# EAGLE design transmitter (EAGLE 5.10)
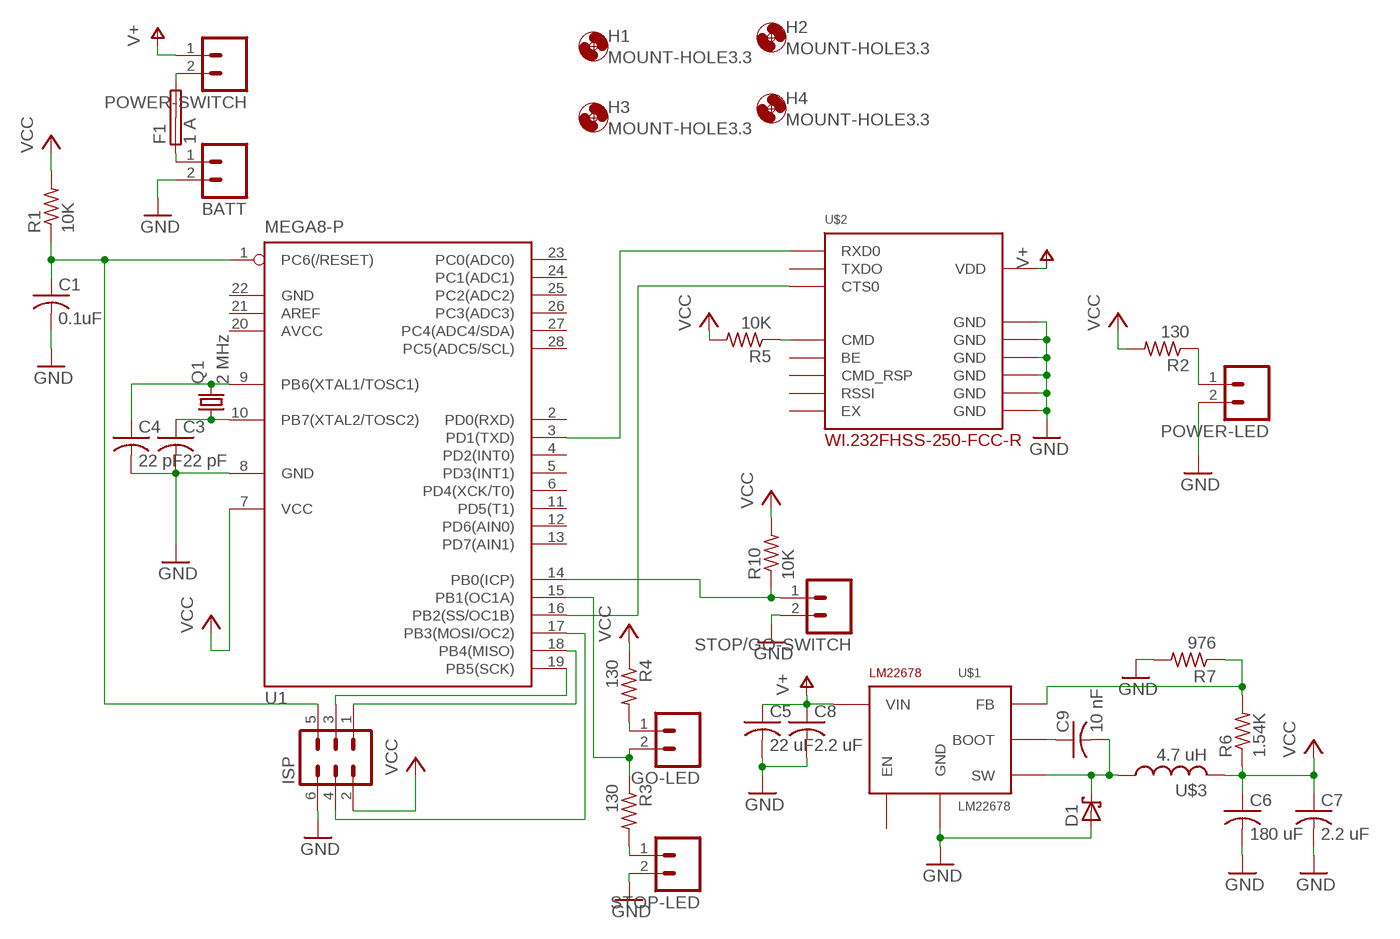
[diagram p0: schematic, sheet 1]

## Parts
BATT  M02POLAR  [MOLEX-1X2]
C1  0.1uF  C-USC1206  [C1206]
C3  22 pF  C-USC1206  [C1206]
C4  22 pF  C-USC1206  [C1206]
C5  22 uF  C-USC1206  [C1206]
C6  180 uF  C-USC1206  [C1206]
C7  2.2 uF  C-USC1206  [C1206]
C8  2.2 uF  C-USC1206  [C1206]
C9  10 nF  C-USC1206  [C1206]
D1  SCHOTTKY-DIODEDO201T15  [DO201T15]
F1  1 A  SHK20Q  [SHK20Q]
GO-LED  M02POLAR  [MOLEX-1X2]
H1  MOUNT-HOLE3.3  [3,3]
H2  MOUNT-HOLE3.3  [3,3]
H3  MOUNT-HOLE3.3  [3,3]
H4  MOUNT-HOLE3.3  [3,3]
ISP  MA03-2  [MA03-2]
POWER-LED  M02POLAR  [MOLEX-1X2]
POWER-SWITCH  M02POLAR  [MOLEX-1X2]
Q1  2 MHz  CRYSTALHC49S  [HC49/S]
R1  10K  R-US_R1206  [R1206]
R2  130  R-US_R1206  [R1206]
R3  130  R-US_R1206  [R1206]
R4  130  R-US_R1206  [R1206]
R5  10K  R-US_R1206  [R1206]
R6  1.54K  R-US_R1206  [R1206]
R7  976  R-US_R1206  [R1206]
R10  10K  R-US_R1206  [R1206]
STOP-LED  M02POLAR  [MOLEX-1X2]
STOP/GO-SWITCH  M02POLAR  [MOLEX-1X2]
U1  MEGA8-P  [DIL28-3]
U$1  LM22678  [TO263-7]
U$2  WI.232FHSS-250-FCC-R  [RADIOTRONIX-EVM]
U$3  4.7 uH  COILTRONICS-DR127  [COILTRONICS-DR127]

## Nets
GND: BATT.2 C1.2 C3.2 C4.2 C5.2 C6.2 C7.2 C8.2 D1.A ISP.6 POWER-LED.2 R7.2 STOP-LED.2 STOP/GO-SWITCH.2 U1.8(GND) U$1.4(GND) U$2.JP1-1(GND) U$2.JP1-2(GND) U$2.JP1-11(GND) U$2.JP1-12(GND) U$2.JP2-11(GND) U$2.JP2-12(GND)
N$1: C3.1 Q1.1 U1.10(PB7(XTAL2/TOSC2))
N$2: C4.1 Q1.2 U1.9(PB6(XTAL1/TOSC1))
N$3: C1.1 ISP.5 R1.1 U1.1(PC6(/RESET))
N$4: F1.2A POWER-SWITCH.2
N$5: BATT.1 F1.1A
N$6: R10.1 STOP/GO-SWITCH.1 U1.14(PB0(ICP))
N$7: R3.2 STOP-LED.1
N$8: GO-LED.1 R4.2
N$9: GO-LED.2 R3.1 U1.15(PB1(OC1A))
N$10: R5.1 U$2.JP2-5(CMD)
N$11: U1.3(PD1(TXD)) U$2.JP2-2(RXD0)
N$12: U1.16(PB2(SS/OC1B)) U$2.JP2-4(CTS0)
N$14: ISP.1 U1.18(PB4(MISO))
N$15: C9.2 D1.C U$1.1(SW) U$3.1
N$17: C9.1 U$1.3(BOOT)
N$18: R6.2 R7.1 U$1.6(FB)
N$28: POWER-LED.1 R2.1
N$31: ISP.3 U1.19(PB5(SCK))
N$33: ISP.4 U1.17(PB3(MOSI/OC2))
V+: C5.1 C8.1 POWER-SWITCH.1 U$1.2(VIN) U$2.JP2-1(VDD)
VCC: C6.1 C7.1 ISP.2 R1.2 R2.2 R4.1 R5.2 R6.1 R10.2 U1.7(VCC) U$3.2
Unconnected: F1.1B F1.2B U1.2(PD0(RXD)) U1.4(PD2(INT0)) U1.5(PD3(INT1)) U1.6(PD4(XCK/T0)) U1.11(PD5(T1)) U1.12(PD6(AIN0)) U1.13(PD7(AIN1)) U1.21(AREF) U1.23(PC0(ADC0)) U1.24(PC1(ADC1)) U1.25(PC2(ADC2)) U1.26(PC3(ADC3)) U1.27(PC4(ADC4/SDA)) U1.28(PC5(ADC5/SCL)) U$1.7(EN) U$2.JP1-3(BE) U$2.JP1-4(CMD_RSP) U$2.JP1-5(RSSI) U$2.JP1-6(EX) U$2.JP2-3(TXDO)

## Power pins joined to a net without a drawn wire
AVCC: U1.20(AVCC)
GND: U1.22(GND)

## Library data of the parts
BATT GO-LED POWER-LED POWER-SWITCH STOP-LED STOP/GO-SWITCH = SparkFun:M02: Header 2 Standard 2-pin 0.1" header. Use with straight break away headers (SKU : PRT-00116), right angle break away headers (PRT-00553), swiss pins (PRT-00743), machine pins (PRT-00117), and female headers (PRT-00115). Molex polarized connector foot print use with SKU : PRT-08233 with associated crimp pins and housings.
C1 C3-C9 = rcl:C-US: CAPACITOR, American symbol
D1 = diode:SCHOTTKY-DIODE: Schottky Diode
F1 = fuse:SHK20Q: FUSE HOLDER 5 x 20 mm, SH contact, E1207 Buerklin 64G6061
H1-H4 = holes:MOUNT-HOLE: MOUNTING HOLE with drill center marker
ISP = con-lstb:MA03-2: PIN HEADER
Q1 = crystal:CRYSTAL: CRYSTAL
R1-R7 R10 = resistor:R-US_: RESISTOR, American symbol
U1 = atmel:MEGA8-P: MICROCONTROLLER 8 Kbytes FLASH, 1 kbytes SRAM, 512 bytes EEPROM, USART, 4-channel 10 bit ADC, 2-channel 8 bit ADC Pin compatible with Atmega48, ATMega88, ATMega168 Source: avr.lbr
U$1 = chicagoedt:LM22678: 5A SIMPLE SWITCHER®, Step-Down Voltage Regulator with Precision Enable
U$2 = chicagoedt:WI.232FHSS-250-FCC-R: 902 - 928 MHz FCC approved Wi.232FHSS-250-R modules with reverse SMA connector
U$3 = chicagoedt:COILTRONICS-DR127: Coiltronics DR127 series surface mount inductor.

## Board
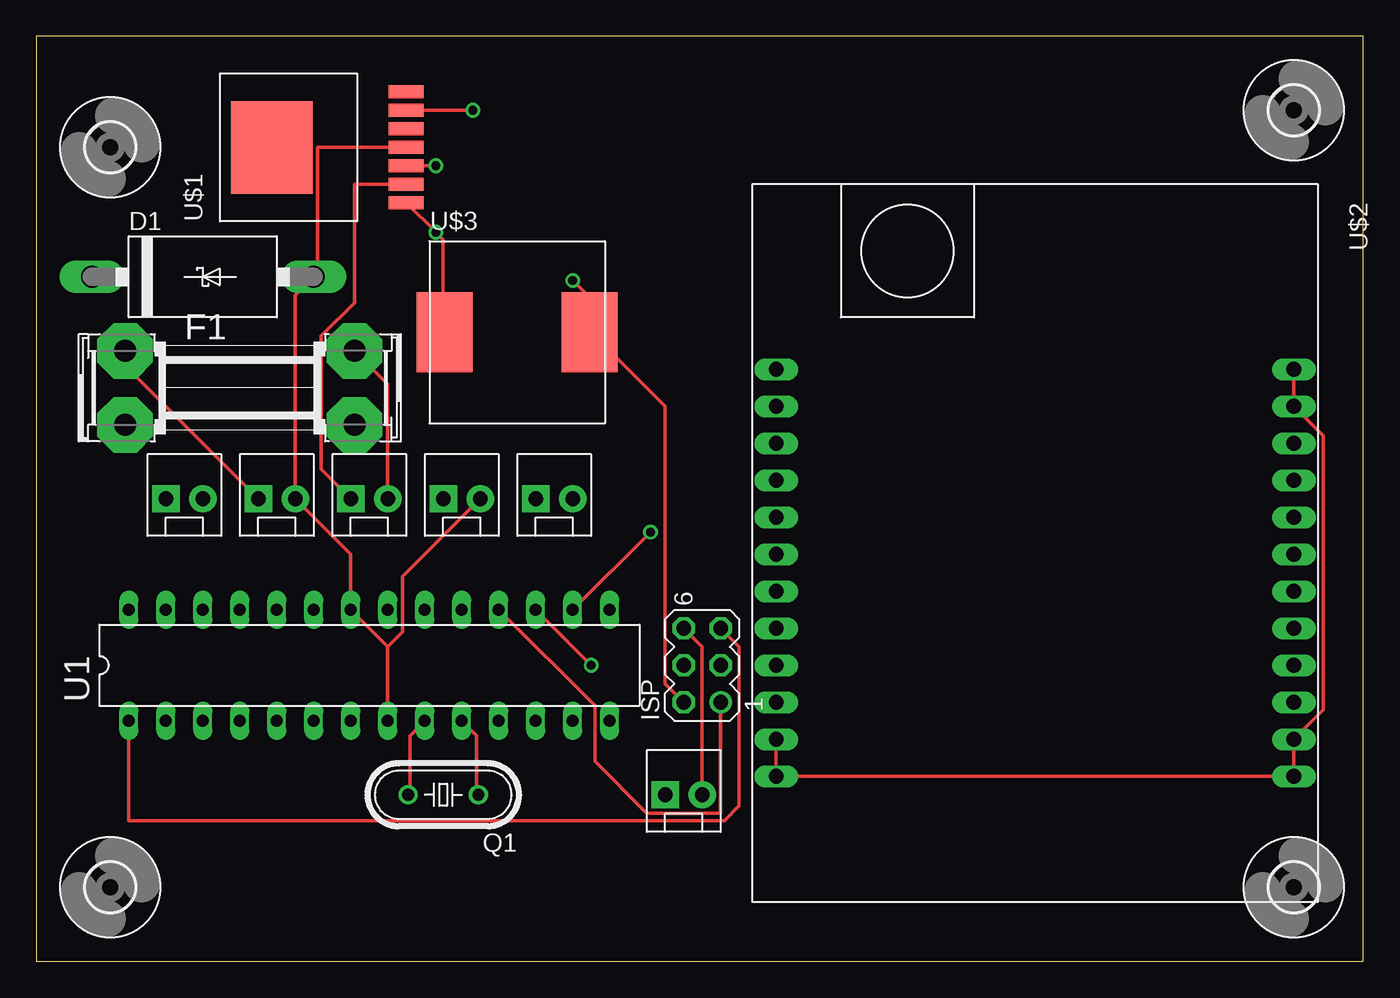
[diagram p1: board, top side]
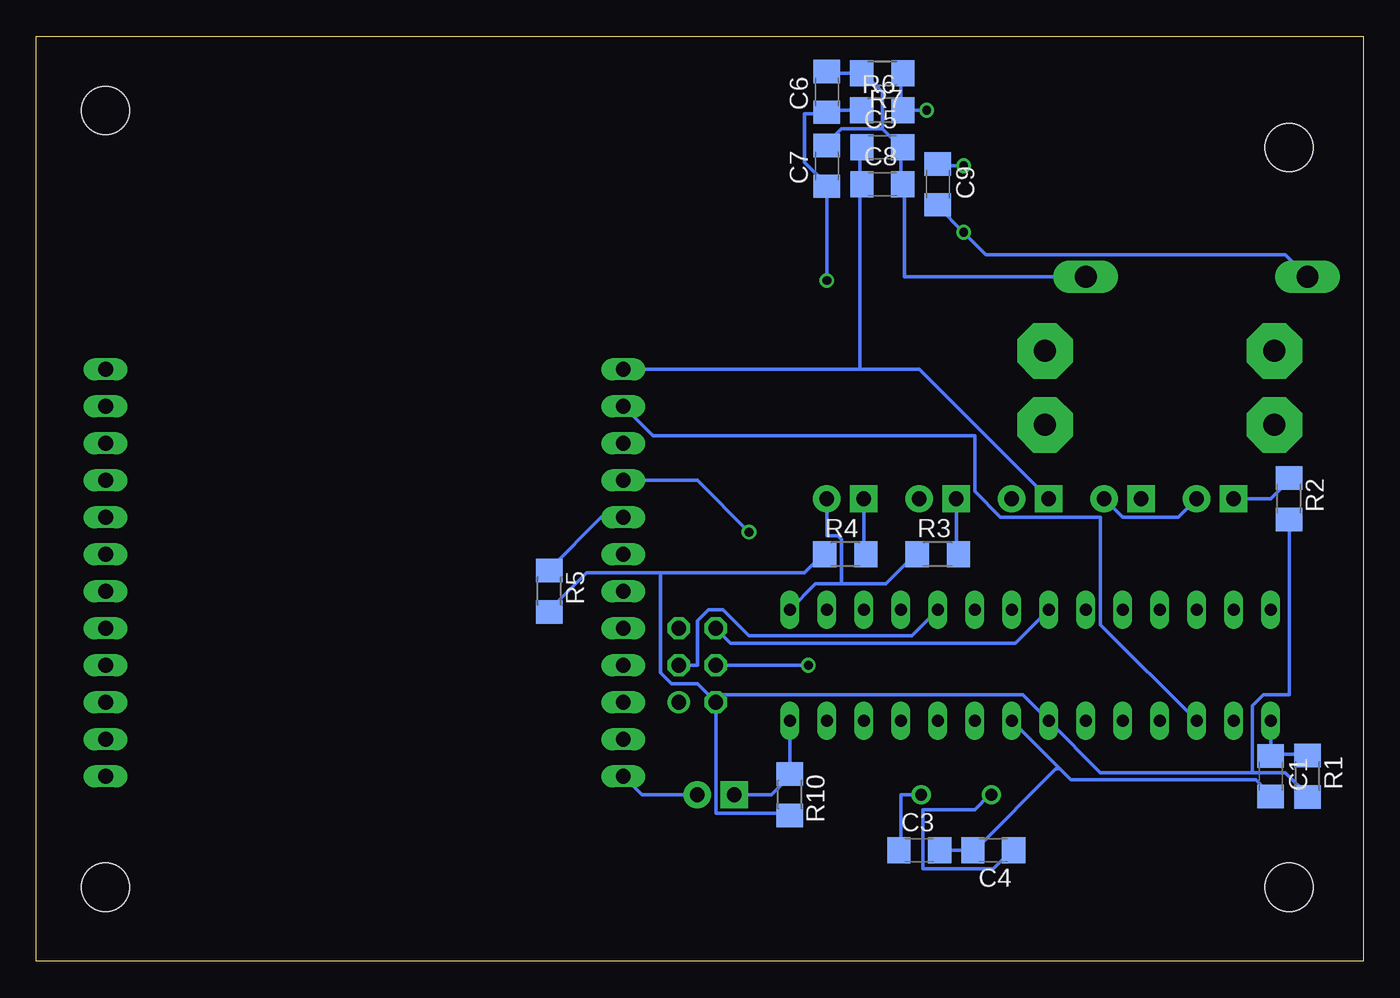
[diagram p2: board, bottom side, seen from below]

Size 91.11 x 63.49 mm. Coordinates in mm from the lower left corner, seen from the top.
Outline: 0,0 91.11,0 91.11,63.49 0,63.49 0,0
Copper layers (1*16): Top 0.035mm / dielectric 1.5mm / Bottom 0.035mm
Design rules "default": minimum track width 10mil, minimum drill 24mil, track to track 8mil, track to pad 8mil, pad to pad 8mil, via to via 8mil, smd to smd 8mil, copper to edge 40mil, drill to drill 8mil, minimum pad ring 10mil, minimum via ring 8mil, stop-mask expansion 4mil, vias tented up to drill 0mil, thermal gap 10mil

### Footprints (pad centres in the part's own frame; a part is rotated, then mirrored left to right if it is on the bottom)
MOLEX-1X2 = drill 1.016 pad 1.88 square: 1 0,0 | drill 1.016 pad 1.88 round: 2 2.54,0
C1206 = smd 1.6 x 1.8: 1 -1.4,0; 2 1.4,0
DO201T15 = drill 1.499 long: A 7.62,0; C -7.62,0
SHK20Q = drill 1.5 pad 3.81 octagon: 1A -7.874,2.54; 1B -7.874,-2.54; 2A 7.874,2.54; 2B 7.874,-2.54
3,3 = hole 3.3: 0,0
MA03-2 = drill 1.016 round: 1 -2.54,-1.27 | drill 1.016 octagon: 2 -2.54,1.27; 3 0,-1.27; 4 0,1.27; 5 2.54,-1.27; 6 2.54,1.27
HC49/S = drill 0.813 round: 1 -2.413,0; 2 2.413,0
R1206 = smd 1.6 x 1.803: 1 -1.422,0; 2 1.422,0
DIL28-3 = drill 0.813 long: 1 -16.51,-3.81; 2 -13.97,-3.81; 3 -11.43,-3.81; 4 -8.89,-3.81; 5 -6.35,-3.81; 6 -3.81,-3.81; 7 -1.27,-3.81; 8 1.27,-3.81; 9 3.81,-3.81; 10 6.35,-3.81; 11 8.89,-3.81; 12 11.43,-3.81; 13 13.97,-3.81; 14 16.51,-3.81; 15 16.51,3.81; 16 13.97,3.81; 17 11.43,3.81; 18 8.89,3.81; 19 6.35,3.81; 20 3.81,3.81; 21 1.27,3.81; 22 -1.27,3.81; 23 -3.81,3.81; 24 -6.35,3.81; 25 -8.89,3.81; 26 -11.43,3.81; 27 -13.97,3.81; 28 -16.51,3.81
TO263-7 = smd 0.91 x 2.41: 1 -3.81,0; 2 -2.54,0; 3 -1.27,0; 4 0,0; 5 1.27,0; 6 2.54,0; 7 3.81,0 | smd 6.35 x 5.59: EP 0,9.225
RADIOTRONIX-EVM = drill 1.016 long: JP1-1 -13.97,17.78; JP1-2 -11.43,17.78; JP1-3 -8.89,17.78; JP1-4 -6.35,17.78; JP1-5 -3.81,17.78; JP1-6 -1.27,17.78; JP1-7 1.27,17.78; JP1-8 3.81,17.78; JP1-9 6.35,17.78; JP1-10 8.89,17.78; JP1-11 11.43,17.78; JP1-12 13.97,17.78; JP2-1 -13.97,-17.78; JP2-2 -11.43,-17.78; JP2-3 -8.89,-17.78; JP2-4 -6.35,-17.78; JP2-5 -3.81,-17.78; JP2-6 -1.27,-17.78; JP2-7 1.27,-17.78; JP2-8 3.81,-17.78; JP2-9 6.35,-17.78; JP2-10 8.89,-17.78; JP2-11 11.43,-17.78; JP2-12 13.97,-17.78
COILTRONICS-DR127 = smd 3.85 x 5.5: 1 -4.975,0; 2 4.975,0

### Placement (x,y rotation side)
BATT  15.24,31.75 0 top
C1  6.35,12.7 270 bottom
C3  30.48,7.62 0 bottom
C4  25.4,7.62 180 bottom
C5  33.02,55.88 0 bottom
C6  36.83,59.69 90 bottom
C7  36.83,54.61 90 bottom
C8  33.02,53.34 0 bottom
C9  29.21,53.34 270 bottom
D1  11.43,46.99 0 top
F1  13.97,39.37 0 top
GO-LED  34.29,31.75 0 top
H1  5.08,5.08 0 top
H2  5.08,55.88 0 top
H3  86.36,5.08 0 top
H4  86.36,58.42 0 top
ISP  45.72,20.32 90 top
POWER-LED  8.89,31.75 0 top
POWER-SWITCH  21.59,31.75 0 top
Q1  27.94,11.43 180 top
R1  3.81,12.7 270 bottom
R2  5.08,31.75 270 bottom
R3  29.21,27.94 0 bottom
R4  35.56,27.94 0 bottom
R5  55.88,25.4 270 bottom
R6  33.02,58.42 0 bottom
R7  33.02,60.96 180 bottom
R10  39.37,11.43 270 bottom
STOP-LED  27.94,31.75 0 top
STOP/GO-SWITCH  43.18,11.43 0 top
U1  22.86,20.32 0 top
U$1  25.4,55.88 90 top
U$2  68.58,26.67 270 top
U$3  33.02,43.18 0 top

### Tracks (layer width: path | path; a pad name or v marks a point on that pad's centre or on a via)
GND
  Top 0.254: U$1.4 19.3,55.88 19.3,47.24 D1.A 17.78,45.72 BATT.2 21.59,27.94 U1.22 24.13,21.59 | U$2.JP1-1 U$2.JP1-2 88.39,36.07 88.39,17.27 U$2.JP1-11 U$2.JP1-12 U$2.JP2-12 U$2.JP2-11 | ISP.6 45.72,21.59 STOP/GO-SWITCH.2 | U1.8 24.13,21.59 | STOP-LED.2 25.15,26.42 25.15,22.61 24.13,21.59
  Bottom 0.254: C6.2 36.83,60.96 R7.2 34.29,60.96 33.02,59.69 33.02,57.15 | 31.75,55.88 31.75,53.34 C8.2 31.5,53.34 31.5,46.99 D1.A | 33.02,57.15 35.81,57.15 36.83,56.13 C7.2 | 31.75,55.88 33.02,57.15 | 31.75,55.88 C5.2 | U$2.JP2-12 49.53,11.43 STOP/GO-SWITCH.2 | POWER-LED.2 12.7,30.48 16.51,30.48 BATT.2 | C3.2 C4.2 26.67,7.62 21.08,13.21 20.83,13.21 | 20.83,13.21 U1.8 | 20.83,13.21 20.07,12.45 7.37,12.45 6.35,11.43 C1.2 | ISP.6 43.43,21.84 23.88,21.84 U1.22
N$1
  Top 0.254: U1.10 30.23,15.49 30.23,11.43 Q1.1
  Bottom 0.254: C3.1 31.75,7.62 31.75,11.43 Q1.1
N$2
  Top 0.254: U1.9 25.65,15.49 25.65,11.43 Q1.2
  Bottom 0.254: C4.1 24.13,7.62 25.4,6.35 30.23,6.35 30.23,10.41 26.67,10.41 25.65,11.43 Q1.2
N$3
  Top 0.254: ISP.5 48.26,21.59 48.26,10.67 47.24,9.65 6.35,9.65 U1.1
  Bottom 0.254: U1.1 6.35,14.22 | 6.35,14.22 3.81,14.22 R1.1 | 6.35,14.22 C1.1
N$4
  Top 0.254: POWER-SWITCH.2 24.13,39.62 F1.2A
N$5
  Top 0.254: BATT.1 6.1,40.89 F1.1A
N$6
  Bottom 0.254: U1.14 R10.1 39.37,12.7 40.64,11.43 STOP/GO-SWITCH.1
N$7
  Bottom 0.254: STOP-LED.1 27.94,27.94 R3.2
N$8
  Bottom 0.254: GO-LED.1 34.29,27.94 R4.2
N$9
  Bottom 0.254: 35.81,25.91 37.59,25.91 U1.15 | 35.81,25.91 32.77,25.91 30.73,27.94 R3.1 | GO-LED.2 36.83,29.21 36.07,29.21 35.81,28.96 35.81,25.91
N$10
  Bottom 0.254: U$2.JP2-5 52.32,30.48 55.88,26.92 R5.1
N$11
  Bottom 0.254: U1.3 18.03,23.11 18.03,30.48 24.89,30.48 26.67,32.26 26.67,36.07 48.77,36.07 U$2.JP2-2
N$12  (via drill 0.61)
  Top 0.254: U1.16 v42.16,29.46
  Bottom 0.254: v42.16,29.46 45.72,33.02 U$2.JP2-4
N$14
  Top 0.254: U1.18 38.35,17.53 38.35,13.72 41.91,10.16 46.99,10.16 ISP.1
N$15  (via drill 0.61)
  Top 0.254: U$1.1 v27.43,50.04 27.94,49.53 27.94,43.18 U$3.1
  Bottom 0.254: D1.C 5.33,48.51 25.91,48.51 v27.43,50.04 29.21,51.82 C9.2
N$17  (via drill 0.61)
  Top 0.254: U$1.3 v27.43,54.61
  Bottom 0.254: v27.43,54.61 29.21,54.61 C9.1
N$18  (via drill 0.61)
  Top 0.254: U$1.6 v29.97,58.42
  Bottom 0.254: R7.1 31.75,60.96 31.75,58.42 R6.2 v29.97,58.42
N$28
  Bottom 0.254: POWER-LED.1 6.35,31.75 5.08,33.02 R2.1
N$31
  Bottom 0.254: U1.19 30.99,22.35 42.16,22.35 43.94,24.13 44.96,24.13 45.72,23.37 45.72,20.32 ISP.3
N$33  (via drill 0.61)
  Top 0.254: U1.17 v38.1,20.32
  Bottom 0.254: v38.1,20.32 ISP.4
V+
  Top 0.254: U$1.2 21.84,53.34 21.84,45.21 19.56,42.93 19.56,33.78 POWER-SWITCH.1
  Bottom 0.254: 34.54,53.34 34.54,55.88 C5.1 | 34.54,40.64 34.54,53.34 | 34.54,40.64 U$2.JP2-1 | 34.54,53.34 C8.1 | POWER-SWITCH.1 30.48,40.64 34.54,40.64
VCC  (via drill 0.61)
  Top 0.254: v36.83,46.74 37.85,45.72 37.85,43.18 U$3.2 38.1,43.18 43.18,38.1 43.18,19.05 ISP.2
  Bottom 0.254: 7.62,12.95 18.03,12.95 U1.7 23.37,18.29 44.96,18.29 | 7.62,12.95 5.33,12.95 3.81,11.43 R1.2 | 7.62,12.95 7.62,17.53 6.86,18.29 5.08,18.29 R2.2 | R6.1 36.83,58.42 C6.1 36.83,58.17 38.35,58.17 38.35,54.86 36.83,53.34 C7.1 v36.83,46.74 | R10.2 39.37,10.16 44.45,10.16 ISP.2 44.96,18.29 | 48.26,26.67 53.34,26.67 55.88,24.13 R5.2 | 48.26,26.67 38.35,26.67 37.08,27.94 R4.1 | 44.96,18.29 45.72,19.05 47.5,19.05 48.26,19.81 48.26,26.67